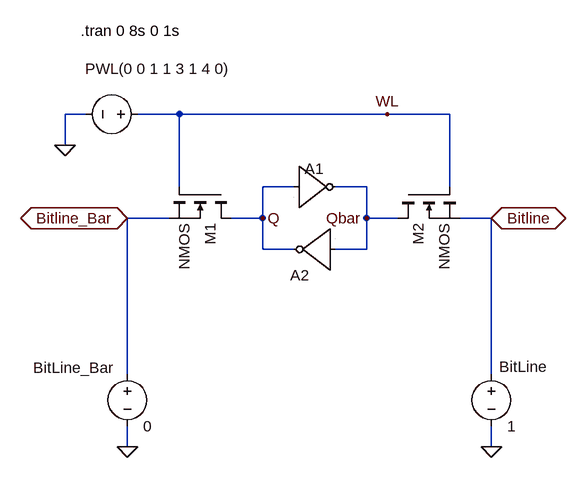
[diagram p0: schematic Reading SRAM Cell.asc]
Reading SRAM Cell.asc, the LTspice schematic file:
Version 4
SHEET 1 880 680
WIRE -144 -32 -176 -32
WIRE 0 -32 -64 -32
WIRE 320 -32 0 -32
WIRE 416 -32 320 -32
WIRE -176 16 -176 -32
WIRE 0 80 0 -32
WIRE 176 80 128 80
WIRE 288 80 240 80
WIRE 416 80 416 -32
WIRE -16 128 -80 128
WIRE 128 128 128 80
WIRE 128 128 80 128
WIRE 288 128 288 80
WIRE 336 128 288 128
WIRE 480 128 432 128
WIRE 128 176 128 128
WIRE 176 176 128 176
WIRE 288 176 288 128
WIRE 288 176 240 176
WIRE -80 368 -80 128
WIRE 480 368 480 128
WIRE -80 480 -80 448
WIRE 480 480 480 448
FLAG 320 -32 WL
FLAG 288 128 Qbar
FLAG 128 128 Q
FLAG -80 480 0
FLAG 480 480 0
FLAG -176 16 0
FLAG 480 128 Bitline
IOPIN 480 128 BiDir
FLAG -80 128 Bitline_Bar
IOPIN -80 128 BiDir
SYMBOL Digital\\inv 176 16 R0
WINDOW 0 17 36 Left 2
SYMATTR InstName A1
SYMBOL Digital\\inv 240 240 R180
SYMATTR InstName A2
SYMBOL nmos 80 80 R90
SYMATTR InstName M1
SYMBOL nmos 336 80 M90
SYMATTR InstName M2
SYMBOL voltage -48 -32 R90
WINDOW 0 50 6 Invisible 2
WINDOW 3 -54 -15 VBottom 2
WINDOW 123 0 0 Left 2
WINDOW 39 0 0 Left 2
WINDOW -1 8 -9 VRight 2
WINDOW -1 8 -8 VRight 2
SYMATTR InstName WL
SYMATTR Value PWL(0 0 1 1 3 1 4 0)
SYMBOL voltage -80 352 R0
WINDOW 0 -145 6 Left 2
SYMATTR InstName BitLine_Bar
SYMATTR Value 0
SYMBOL voltage 480 352 R0
WINDOW 0 12 5 Left 2
SYMATTR InstName BitLine
SYMATTR Value 1
TEXT -152 -160 Left 2 !.tran 0 8s 0 1s

The netlist it stands for:
* Reading SRAM Cell.asc
A1 Q 0 0 0 0 Qbar 0 0 BUF
A2 Qbar 0 0 0 0 Q 0 0 BUF
M1 Q WL Bitline_Bar Bitline_Bar NMOS
M2 Qbar WL Bitline Bitline NMOS
V§WL WL 0 PWL(0 0 1 1 3 1 4 0)
V§BitLine_Bar Bitline_Bar 0 0
V§BitLine Bitline 0 1
.model NMOS NMOS
.model PMOS PMOS
.lib standard.mos
.tran 0 8s 0 1s
.backanno
.end

* Results of the author's LTspice run, read from the files saved beside the schematic
* Operating Point, zero values left out:
*   V(q) = 1 V
*   V(qbar) = 207 mV
*   V(bitline) = 1 V
*   Id(M2) = -207 mA
*   Ib(M2) = 207 mA
*   Id(M1) = 2.01 pA
*   Ib(M1) = -1.01 pA
*   I(Bitline) = -207 mA
*   I(Bitline_bar) = 2.01 pA
*   I8(A2) = 2.01 pA
*   I6(A2) = -2.01 pA
*   I8(A1) = -207 mA
*   I6(A1) = 207 mA
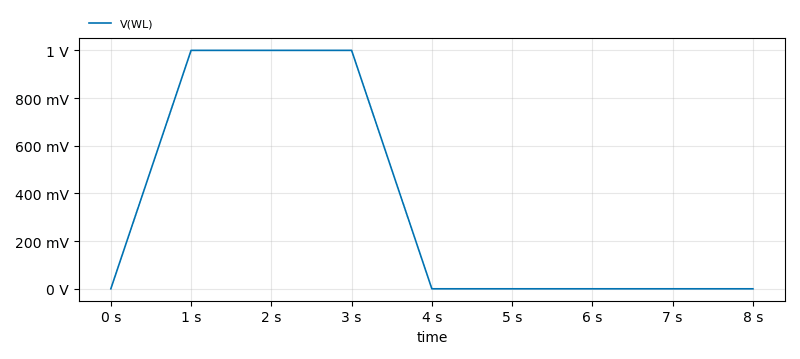
[diagram p1: Transient Analysis of Reading SRAM Cell.asc, plotted from the saved traces]
* Transient Analysis, 1 run:
*   V(WL): min 0 V, max 1 V, average 375 mV, rms 577.8 mV, last 0 V